# EAGLE design 3DG (EAGLE 6.6.0)
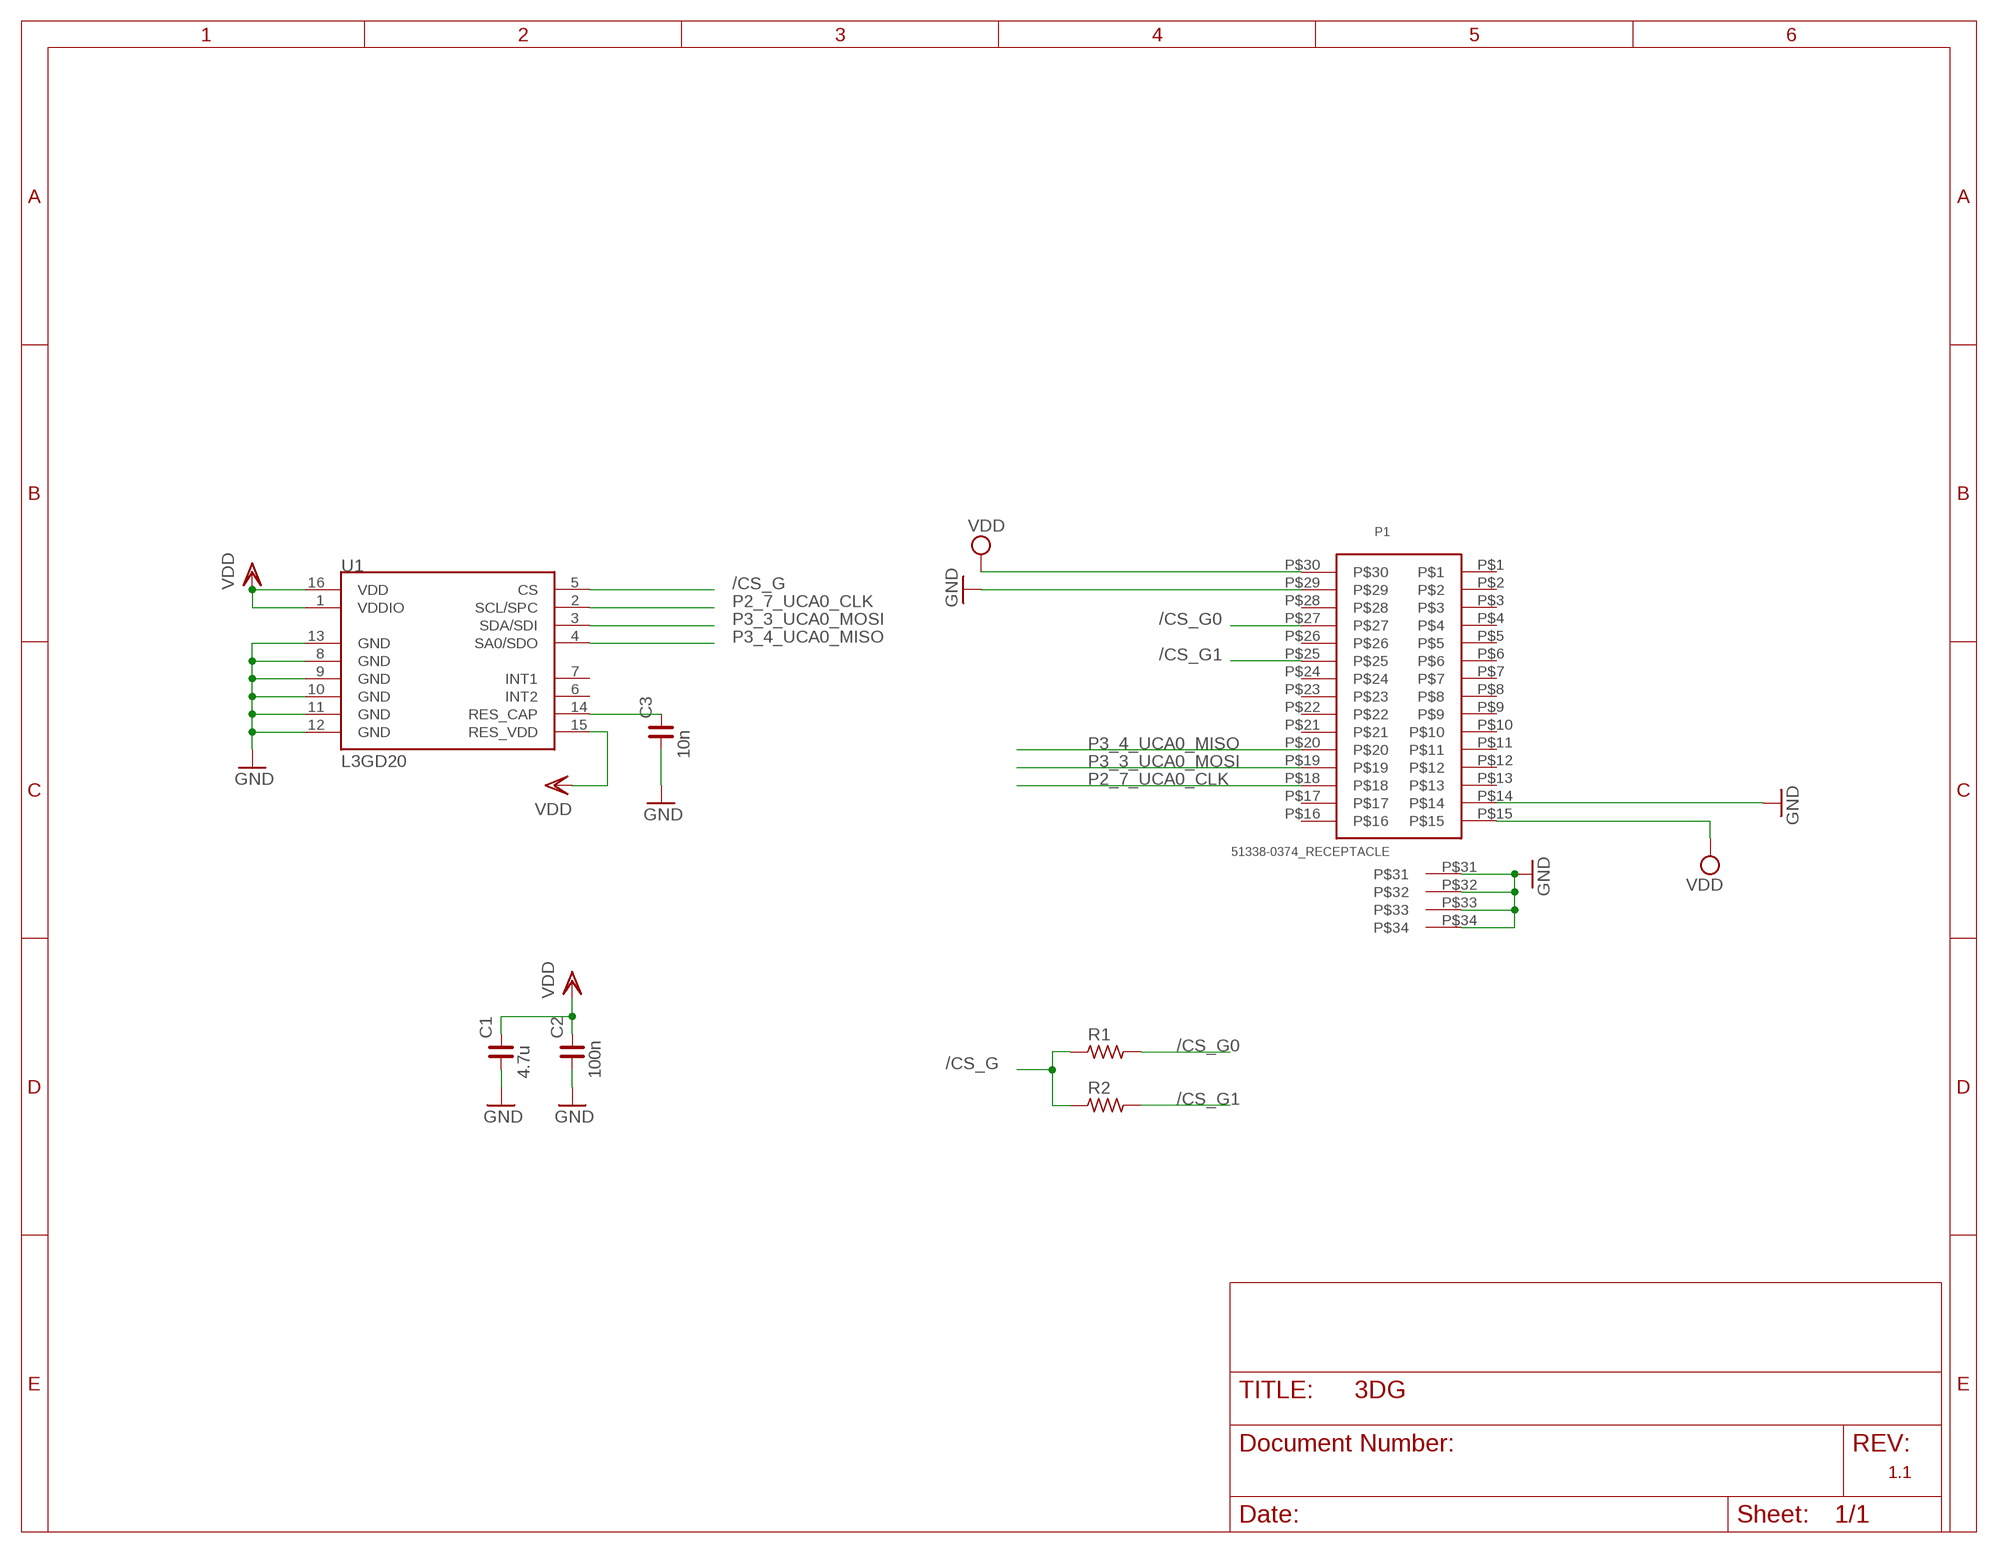
[diagram p0: schematic, sheet 1]

## Parts
C1  4.7u  C_0402  [C0402]
C2  100n  C_0402  [C0402]
C3  10n  C_0402  [C0402]
P1  51338-0374_RECEPTACLE  [51338-0374_RECEPTACLE]
R1  R_0402  [R0402]
R2  R_0402  [R0402]
U1  L3GD20  [LGA16-4X4]

## Nets
/CS_G: R1.1 R2.1 U1.5(CS)
/CS_G0: P1.P$27 R1.2
/CS_G1: P1.P$25 R2.2
GND: C1.1 C2.1 C3.1 P1.P$14 P1.P$29 P1.P$31 P1.P$32 P1.P$33 P1.P$34 U1.8(GND) U1.9(GND) U1.10(GND) U1.11(GND) U1.12(GND) U1.13(GND)
N$1: C3.2 U1.14(RES_CAP)
P2_7_UCA0_CLK: P1.P$18 U1.2(SCL/SPC)
P3_3_UCA0_MOSI: P1.P$19 U1.3(SDA/SDI)
P3_4_UCA0_MISO: P1.P$20 U1.4(SA0/SDO)
VDD: C1.2 C2.2 P1.P$15 P1.P$30 U1.1(VDDIO) U1.15(RES_VDD) U1.16(VDD)
Unconnected: P1.P$1 P1.P$2 P1.P$3 P1.P$4 P1.P$5 P1.P$6 P1.P$7 P1.P$8 P1.P$9 P1.P$10 P1.P$11 P1.P$12 P1.P$13 P1.P$16 P1.P$17 P1.P$21 P1.P$22 P1.P$23 P1.P$24 P1.P$26 P1.P$28 U1.6(INT2) U1.7(INT1)

## Notes on the sheet
- 1.1

## Library data of the parts
C1-C3 = rc-master-smd:C_: NON-POLARIZED CAP
P1 = Molex_SlimStack:51338-0374_RECEPTACLE
R1 R2 = rc-master-smd:R_: RESISTOR
U1 = SparkFun-Sensors:L3GD20

## Board
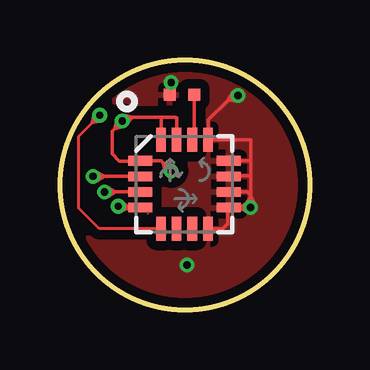
[diagram p1: board, top side]
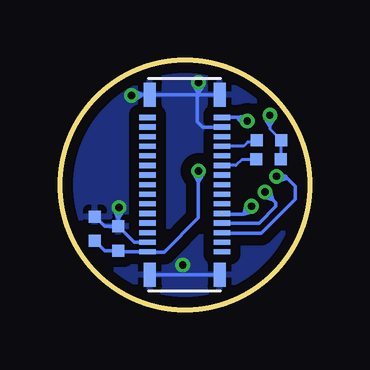
[diagram p2: board, bottom side, seen from below]

Size 10.4 x 10.4 mm. Coordinates in mm from the lower left corner, seen from the top.
Outline: circle at 5.2,5.2 radius 5.2
Copper layers (1*16): Top 0.035mm / dielectric 1.5mm / Bottom 0.035mm
Design rules "DIRTY_PCB": minimum track width 5mil, minimum drill 12mil, track to track 5mil, track to pad 5mil, pad to pad 5mil, via to via 5mil, smd to smd 0mil, copper to edge 10mil, drill to drill 10mil, minimum pad ring 10mil, minimum via ring 6mil, stop-mask expansion 2mil, vias tented up to drill 25mil, thermal gap 10mil

### Footprints (pad centres in the part's own frame; a part is rotated, then mirrored left to right if it is on the bottom)
C0402 = smd 0.5 x 0.5: 1 -0.508,0; 2 0.508,0
51338-0374_RECEPTACLE = smd 0.7 x 0.22: P$1 -1.55,2.8; P$2 -1.55,2.4; P$3 -1.55,2; P$4 -1.55,1.6; P$5 -1.55,1.2; P$6 -1.55,0.8; P$7 -1.55,0.4; P$8 -1.55,0; P$9 -1.55,-0.4; P$10 -1.55,-0.8; P$11 -1.55,-1.2; P$12 -1.55,-1.6; P$13 -1.55,-2; P$14 -1.55,-2.4; P$15 -1.55,-2.8; P$16 1.55,-2.8; P$17 1.55,-2.4; P$18 1.55,-2; P$19 1.55,-1.6; P$20 1.55,-1.2; P$21 1.55,-0.8; P$22 1.55,-0.4; P$23 1.55,0; P$24 1.55,0.4; P$25 1.55,0.8; P$26 1.55,1.2; P$27 1.55,1.6; P$28 1.55,2; P$29 1.55,2.4; P$30 1.55,2.8 | smd 0.5 x 1: P$31 1.45,3.75; P$32 -1.45,3.75; P$33 -1.45,-3.75; P$34 1.45,-3.75
R0402 = smd 0.5 x 0.5: 1 -0.508,0; 2 0.508,0
LGA16-4X4 = smd 1 x 0.4: 1 -1.85,0.975; 2 -1.85,0.325; 3 -1.85,-0.325; 4 -1.85,-0.975; 9 1.85,-0.975; 10 1.85,-0.325; 11 1.85,0.325; 12 1.85,0.975 | smd 0.4 x 1: 5 -0.975,-1.85; 6 -0.325,-1.85; 7 0.325,-1.85; 8 0.975,-1.85; 13 0.975,1.85; 14 0.325,1.85; 15 -0.325,1.85; 16 -0.975,1.85

### Placement (x,y rotation side)
C1  8.95,3.37 270 bottom
C2  7.97,2.96 270 bottom
C3  5.08,8.95 0 top
P1  5.2,5.21 0 bottom
R1  1.69,7.06 180 bottom
R2  1.71,6.26 180 bottom
U1  5.18,5.23 0 top

### Tracks (layer width: path | path; a pad name or v marks a point on that pad's centre or on a via)
/CS_G  (via drill 0.3)
  Top 0.127: U1.5 1.64,3.38 0.79,4.22 0.79,7.23 1.33,7.78 | 1.33,7.78 v1.66,8.1 | 1.33,7.78 1.71,7.86 v1.66,8.1 | 1.33,7.78 1.42,8.15 v1.66,8.1
  Bottom 0.127: R1.1 1.2,7.04 R2.1 | R1.1 1.2,7.03 1.2,6.17 1.24,6.22 1.39,6.22 | v1.66,8.1 1.66,7.64 | 1.66,7.64 1.66,7.53 R1.1 | 1.66,7.64 1.86,7.97 v1.66,8.1 | 1.66,7.64 1.45,7.97 v1.66,8.1
/CS_G0
  Bottom 0.127: R1.2 2.28,6.98 2.58,6.98 2.75,6.81 P1.P$27
/CS_G1
  Bottom 0.127: R2.2 2.22,6.25 2.83,6.25 3.07,6.01 P1.P$25
GND  (via drill 0.3)
  Top 0.152: C3.1 4.63,9.01 | 4.63,9.01 v4.63,9.46 | 7,8.72 6.18,7.9 6.18,7.1 U1.13 7.94,7.08 7.94,6.2 | 7,8.72 7.2,8.92 v7.42,8.92 | v7.94,4.25 7.48,4.25 | 7.48,4.25 U1.9 7,4.22 7,3.59 6.79,3.38 U1.8 | U1.10 7.81,4.9 7.94,4.77 | 7.94,4.77 7.94,4.71 | U1.11 7.06,5.58 7.94,5.58 | 7.94,5.58 7.94,4.77 | 7.94,4.71 v7.94,4.25 | U1.12 7.94,6.2 | 7.94,6.2 7.94,5.58 | 4.63,9.01 4.83,9.35 v4.63,9.46 | 4.63,9.01 4.43,9.35 v4.63,9.46 | 7,8.72 7.4,8.69 v7.42,8.92 | 7,8.72 7.23,9.05 v7.42,8.92 | 7.48,4.25 7.83,4.05 v7.94,4.25 | 7.48,4.25 7.83,4.45 v7.94,4.25 | 7.94,4.71 7.74,4.37 v7.94,4.25 | 7.94,4.71 8.14,4.37 v7.94,4.25
  Bottom 0.152: v4.63,9.46 4.63,9.01 | 4.63,9.01 4.63,8.96 P1.P$31 C3.1 | C3.1 P1.P$32 6.96,8.96 | v7.42,8.92 7.38,8.96 6.96,8.96 | P1.P$29 4.46,7.61 4.67,7.82 4.67,8.86 C3.1 | C2.1 8.54,3.47 C1.1 | C2.1 7.97,3.8 | 7.97,3.8 7.97,4.22 v7.94,4.25 | P1.P$34 P1.P$33 | P1.P$14 7.31,2.81 C2.1 | 4.63,9.01 4.83,9.35 v4.63,9.46 | 4.63,9.01 4.43,9.35 v4.63,9.46 | 6.96,8.96 7.29,8.73 v7.42,8.92 | 6.96,8.96 7.32,9.12 v7.42,8.92 | 7.97,3.8 8.15,4.15 v7.94,4.25 | 7.97,3.8 7.75,4.13 v7.94,4.25
  other vias: 5.29,1.86
  pour Top (isolate 0.4): 0.2,5.2 arc-90 5.2,10.2 arc-90 10.2,5.2 arc-90 5.2,0.2 arc-91
  pour Bottom (isolate 0.432): 0.2,5.2 arc-90 5.2,10.2 arc-90 10.2,5.2 arc-90 5.2,0.2 arc-91
N$1
  Top 0.152: U1.14 5.59,7.16 C3.2
P2_7_UCA0_CLK  (via drill 0.3)
  Top 0.152: v1.38,5.55 1.46,5.55 1.84,5.55 | 1.84,5.55 U1.2 | 1.84,5.55 1.49,5.75 v1.38,5.55 | 1.84,5.55 1.49,5.36 v1.38,5.55
  Bottom 0.152: P1.P$18 3.63,3.18 2.01,3.18 0.59,4.6 0.59,5.15 0.93,5.48 | 0.93,5.48 1,5.55 v1.38,5.55 | 0.93,5.48 1.3,5.34 v1.38,5.55 | 0.93,5.48 1.24,5.73 v1.38,5.55
P3_3_UCA0_MOSI  (via drill 0.3)
  Top 0.152: v1.85,4.9 v1.86,4.9 2.31,4.9 | 2.31,4.9 U1.3 | 2.31,4.9 1.97,5.1 v1.85,4.9 | 2.31,4.9 1.97,4.7 v1.85,4.9
  Bottom 0.152: P1.P$19 2.1,3.61 1.41,4.3 1.41,4.45 1.53,4.58 | 1.53,4.58 v1.85,4.9 | 1.53,4.58 1.91,4.68 v1.85,4.9 | 1.53,4.58 1.63,4.96 v1.85,4.9
P3_4_UCA0_MISO  (via drill 0.3)  (1 unrouted)
  Top 0.152: v2.43,4.3 2.48,4.25 2.88,4.25 | 2.88,4.25 U1.4 | 2.88,4.25 2.56,4.49 v2.43,4.3 | 2.88,4.25 2.52,4.1 v2.43,4.3
  Bottom 0.152: 3.63,3.98 2.75,3.98 | 2.75,3.98 2.74,3.98 2.43,4.3 v2.43,4.3 | 2.75,3.98 2.65,4.37 v2.43,4.3 | 2.75,3.98 2.37,4.08 v2.43,4.3
VDD  (via drill 0.3)
  Top 0.152: 2.27,7.54 2.17,7.44 2.17,6.49 2.48,6.18 3.31,6.18 U1.1 4.21,6.2 4.31,6.1 | 2.27,7.54 v2.6,7.86 | v2.6,7.86 2.75,8.01 3.03,8.01 | 3.03,8.01 4.21,8.01 | 4.21,8.01 U1.16 | U1.15 4.86,7.99 4.83,8.01 4.21,8.01 | v4.63,5.78 4.31,6.1 | 2.27,7.54 2.66,7.64 v2.6,7.86 | 2.27,7.54 2.38,7.92 v2.6,7.86 | 3.03,8.01 2.64,8.09 v2.6,7.86 | 3.03,8.01 2.77,7.71 v2.6,7.86 | 4.31,6.1 4.41,5.72 v4.63,5.78 | 4.31,6.1 4.69,6 v4.63,5.78
  Bottom 0.152: P1.P$30 3.03,8.01 | 3.03,8.01 2.74,8.01 v2.6,7.86 | C1.2 8.54,2.45 C2.2 7.92,2.41 P1.P$15 6.74,2.4 6.06,2.4 4.63,3.82 4.63,5.32 | 4.63,5.32 v4.63,5.78 | 3.03,8.01 2.64,8.09 v2.6,7.86 | 3.03,8.01 2.77,7.71 v2.6,7.86 | 4.63,5.32 4.83,5.67 v4.63,5.78 | 4.63,5.32 4.43,5.67 v4.63,5.78